# Altium schematic sheet Индикатор с драйвером.SchDoc
size A4
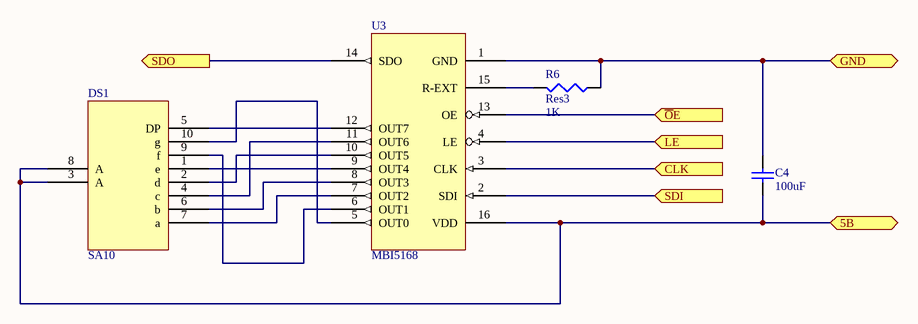
[diagram p0: Индикатор с драйвером.SchDoc]

## Parts
C4  value 100uF  [CAPC1608L]  (hidden comment: Cap Semi)
DS1  SA10  [SA10-21_SMD]
R6  Res3  value 1K  [RESC1608L]
U3  MBI5168  [SO-16_M]

## Ports
5В, CLK (in), GND, LE (in), SDI (in), SDO (out), ~{O}E (in)

## Nets
5В: C4.2 DS1.3(A) DS1.8(A) U3.16(VDD) ; port 5В
~{O}E: U3.13(OE) ; port ~{O}E
CLK: U3.3(CLK) ; port CLK
GND: C4.1 R6.1 U3.1(GND) ; port GND
LE: U3.4(LE) ; port LE
SDI: U3.2(SDI) ; port SDI
SDO: U3.14(SDO) ; port SDO
NetDS1_1: DS1.1(e) U3.9(OUT4)
NetDS1_2: DS1.2(d) U3.10(OUT5)
NetDS1_4: DS1.4(c) U3.11(OUT6)
NetDS1_5: DS1.5(DP) U3.12(OUT7)
NetDS1_6: DS1.6(b) U3.8(OUT3)
NetDS1_7: DS1.7(a) U3.7(OUT2)
NetDS1_9: DS1.9(f) U3.6(OUT1)
NetDS1_10: DS1.10(g) U3.5(OUT0)
NetR6_2: R6.2 U3.15(R-EXT)

## Library data of the parts
C4 = Cap Semi: Capacitor (Semiconductor SIM Model); Published: 8-Jun-2000; LatestRevisionDate: 29-May-2009; LatestRevisionNote: IPC-7351 Footprint Added.; PackageReference: C1206; Publisher: Altium Limited; PackageDescription: Chip Capacitor
DS1 = SA10-21GWA: KingBright, SA10-21GWA
R6 = Res3: Resistor; Published: 8-Jun-2000; LatestRevisionDate: 29-May-2009; LatestRevisionNote: IPC-7351 Footprint Added.; PackageReference: J1-0603; Publisher: Altium Limited; PackageDescription: Chip Resistor
U3 = MBI5168: Macroblock, 8-bit Constant Current LED Sink Driver